# Altium project 4CH_PT100_INPUT_ISO.PrjPcb
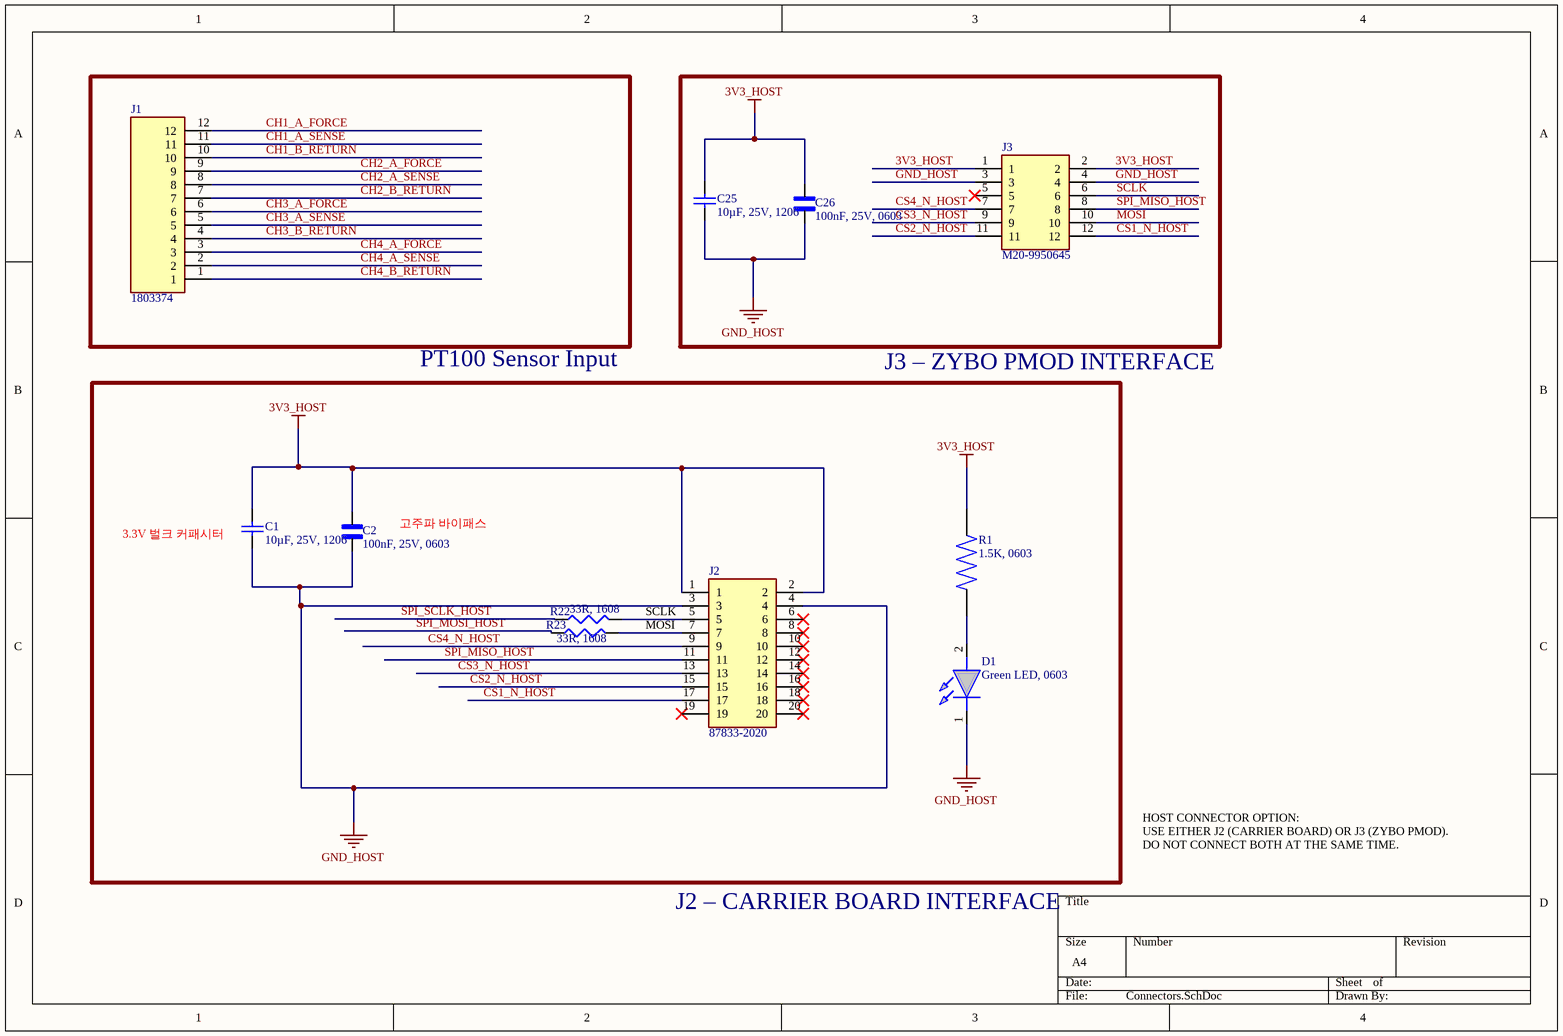
[diagram p0: Connectors.SchDoc]
5 sheets, 83 parts. Net scope: global (net labels, ports and power ports of the same name join across sheets).
Board file: 4CH_PT100_INPUT_ISO.PcbDoc
Sheets:
  Connectors.SchDoc
  CH1_CH2.SchDoc
  CH3_CH4.SchDoc
  ISOLATION.SchDoc
  TestPoint.SchDoc

## Sheet Connectors.SchDoc
size A4; SheetNumber: 1; SheetTotal: 5

### Parts
C1  10µF, 25V, 1206  [C1206]
C2  100nF, 25V, 0603  [CAPC1608X90N]
C25  10µF, 25V, 1206  [C1206]
C26  100nF, 25V, 0603  [CAPC1608X90N]
D1  Green LED, 0603  [LEDC1608X75N]
J1  1803374  [1803374]
J2  87833-2020  [SHDRRA20W55P200_2X10_2265X640X630P]
J3  M20-9950645  [HDRRA12W66P254_2X6_1524X254X508P]
R1  1.5K, 0603  [RESC1607X60N]
R22  33R, 1608  [J1-0603]
R23  33R, 1608  [J1-0603]

### Nets
3V3_HOST: C1.2 C2.2 C25.2 C26.2 J2.1 J2.2 J3.1 J3.2 R1.1
GND_HOST: C1.1 C2.1 C25.1 C26.1 D1.1(K) J2.3 J2.4 J3.3 J3.4
CH1_A_FORCE: J1.12
CH1_A_SENSE: J1.11
CH1_B_RETURN: J1.10
CH2_A_FORCE: J1.9
CH2_A_SENSE: J1.8
CH2_B_RETURN: J1.7
CH3_A_FORCE: J1.6
CH3_A_SENSE: J1.5
CH3_B_RETURN: J1.4
CH4_A_FORCE: J1.3
CH4_A_SENSE: J1.2
CH4_B_RETURN: J1.1
CS1_N_HOST: J2.17 J3.12
CS2_N_HOST: J2.15 J3.11
CS3_N_HOST: J2.13 J3.9
CS4_N_HOST: J2.9 J3.7
MOSI: J2.7 J3.10 R23.2
SCLK: J2.5 J3.6 R22.2
SPI_MISO_HOST: J2.11 J3.8
SPI_MOSI_HOST: R23.1
SPI_SCLK_HOST: R22.1
NetD1_2: D1.2(A) R1.2

Not connected (* = marked no-connect by the designer): J2 6* 8* 10* 12* 14* 16* 18* 19* 20*; J3 5*

### Notes on the sheet
- PT100 Sensor Input
- J3 – ZYBO PMOD INTERFACE
- (near C1) 3.3V 벌크 커패시터
- (near C2) 고주파 바이패스
- HOST CONNECTOR OPTION:
  USE EITHER J2 (CARRIER BOARD) OR J3 (ZYBO PMOD).
  DO NOT CONNECT BOTH AT THE SAME TIME.
- J2 – CARRIER BOARD INTERFACE

### Library data of the parts
C1 C25 = Cap Semi: 10µF, 25V, X7R, ±5%, 1206 / C1206C106J3RACTU; Value: 10uF; Published: 8-Jun-2000; LatestRevisionDate: 29-May-2009; LatestRevisionNote: IPC-7351 Footprint Added.; PackageReference: C1206; Publisher: Altium Limited; PackageDescription: Chip Capacitor
C2 C26 = CL10B104KA8VPJC: Multilayer Ceramic Capacitors MLCC - SMD/SMT; MF: Samsung Electro-Mechanics; SnapEDA_Link: https://www.snapeda.com/parts/CL10B104KA8VPJC/Samsung/view-part/?ref=snap; Package: SMD-2 Samsung; Value: *; MP: CL10B104KA8VPJC; Check_prices: https://www.snapeda.com/parts/CL10B104KA8VPJC/Samsung/view-part/?ref=eda
D1 = KPH-1608SGC: Green Chip LED 1.6x0.8mm Kingbright KPH-1608SGC, 603 Series Green LED, 568 nm 1608 (0603), Rectangle Lens SMD package; Geometry.Height: 0.75mm; element14 Part Number: *; element14 Price/Stock: *; Manufacturer_Name: Kingbright; Manufacturer_Part_Number: KPH-1608SGC; Datasheet Link: https://kingbright-europe.de/_daten/2013-2015KBE-P005-023-SMD-LED.pdf
J1 = 1803374: MC 1,5/12-G-3,81 - PCB headers, nominal cross section: 1.5 mm<sup>2</sup>, color: green, nominal current: 8 A, rated voltage (III/2): 160 V, contact surface: Sn, contact connection type: Pin, number of potentials: 12, number of rows: 1, number of positions: 12, number of connections: 12, product range: MC 1,5/..-G, pitch: 3.81 mm, screw head form: L Slotted, mounting: Wave soldering, pin layout: Linear pinning, solder pin [P]: 3.4 mm, number of solder pins per potential: 1, plug-in system: COMBICON MC 1,5,; Manufacturer_Name: Phoenix Contact; Geometry.Height: 8.25mm; Manufacturer_Part_Number: 1803374; Mouser Part Number: 651-1803374; Mouser Price/Stock: https://www.mouser.co.uk/ProductDetail/Phoenix-Contact/1803374?qs=%2FbRkJSLTVS9mX%2FTOf8pTQA%3D%3D; Arrow Part Number: 1803374; Arrow Price/Stock: https://www.arrow.com/en/products/1803374/phoenix-contact?utm_currency=USD&region=nac; Datasheet Link: https://www.phoenixcontact.com/en-us/products/pcb-header-mc-1512-g-381-1803374?type=pdf
J2 = 87833-2020: Milli-Grid 2.0mm Header rightangle 20way Molex 87833 Series, 2mm Pitch 20 Way 2 Row Right Angle PCB Header, Solder Termination, 2A; Geometry.Height: 6.3mm; Mouser Part Number: 538-87833-2020; Mouser Price/Stock: https://www.mouser.co.uk/ProductDetail/Molex/87833-2020?qs=9Wl4wMk6NjqIn8s9c3rdaw%3D%3D; Manufacturer_Name: Molex; Manufacturer_Part_Number: 87833-2020; Datasheet Link: https://www.molex.com/pdm_docs/sd/878332020_sd.pdf
J3 = M20-9950645: M20: 6+6 Pos Plug DIL Right-Angle 3mm THT Connector 6.1mm pin Gold; Manufacturer_Name: Harwin; Geometry.Height: 5.08mm; Mouser Part Number: 855-M20-9950645; Mouser Price/Stock: https://www.mouser.co.uk/ProductDetail/Harwin/M20-9950645?qs=WS5Jv%252B%252Bx1qVrnrdlGO%252BcnA%3D%3D; Manufacturer_Part_Number: M20-9950645; Datasheet Link: https://content.harwin.com/m/2bbbbcb217f49919/original/DRG-00474-Technical-Drawing-Datasheet-M20-995-pdf.pdf
R1 = RC0603FR-071K5L: 1.5 kOhms Â±1% 0.1W, 1/10W Chip Resistor 0603 (1608 Metric) Moisture Resistant Thick Film; MF: Yageo; SnapEDA_Link: https://www.snapeda.com/parts/RC0603FR-071K5L/Yageo/view-part/?ref=snap; Package: 0603 Yageo; Value: *; MP: RC0603FR-071K5L; Check_prices: https://www.snapeda.com/parts/RC0603FR-071K5L/Yageo/view-part/?ref=eda
R22 R23 = Res3: Resistor; Published: 8-Jun-2000; LatestRevisionDate: 29-May-2009; LatestRevisionNote: IPC-7351 Footprint Added.; PackageReference: J1-0603; Publisher: Altium Limited; PackageDescription: Chip Resistor; Value: 33R

## Sheet CH1_CH2.SchDoc
size A4; SheetNumber: 2; SheetTotal: 5
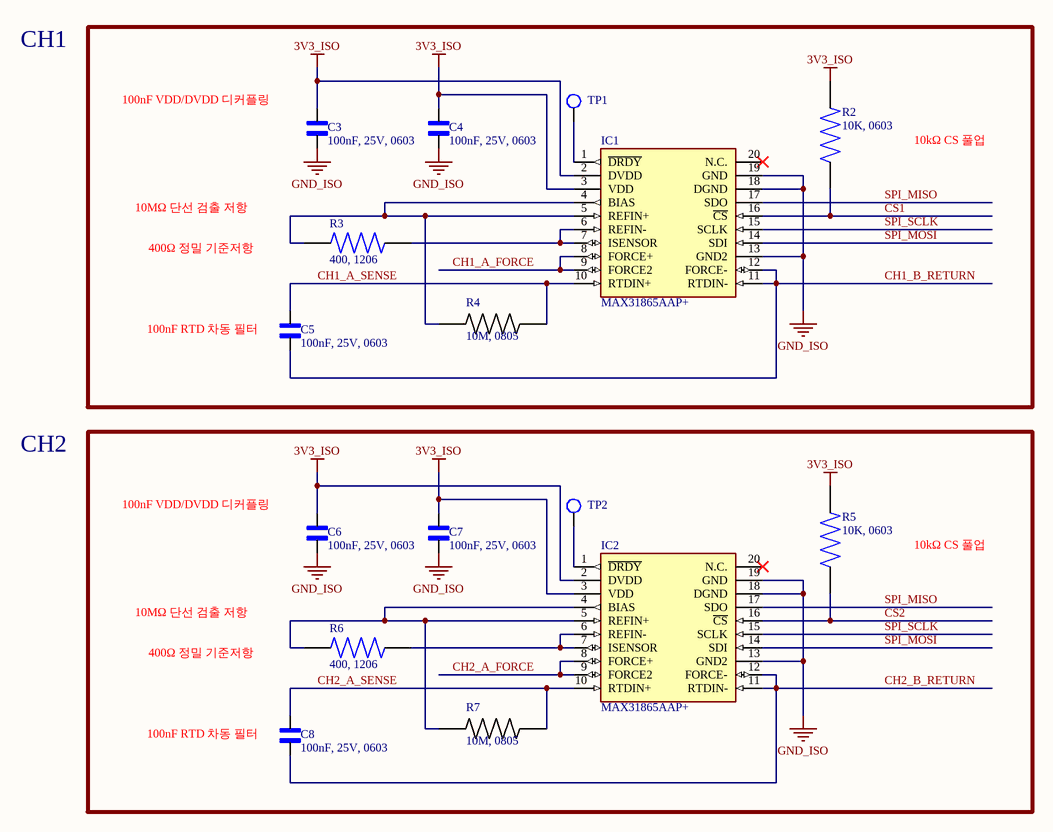
[diagram p1: CH1_CH2.SchDoc]

### Parts
C3  100nF, 25V, 0603  [CAPC1608X90N]
C4  100nF, 25V, 0603  [CAPC1608X90N]
C5  100nF, 25V, 0603  [CAPC1608X90N]
C6  100nF, 25V, 0603  [CAPC1608X90N]
C7  100nF, 25V, 0603  [CAPC1608X90N]
C8  100nF, 25V, 0603  [CAPC1608X90N]
IC1  MAX31865AAP+  [SOP65P778X199-20N]
IC2  MAX31865AAP+  [SOP65P778X199-20N]
R2  10K, 0603  [RESC1607X60N]
R3  400, 1206  [RESC3116X65N]
R4  10M, 0805  [*RESC2012X60N]
R5  10K, 0603  [RESC1607X60N]
R6  400, 1206  [RESC3116X65N]
R7  10M, 0805  [*RESC2012X60N]
TP1  TEST POINT  [TESTPOINT]  (value not drawn)
TP2  TEST POINT  [TESTPOINT]  (value not drawn)

### Nets
3V3_ISO: C3.2 C4.2 C6.2 C7.2 IC1.2(DVDD) IC1.3(VDD) IC2.2(DVDD) IC2.3(VDD) R2.2 R5.2
GND_ISO: C3.1 C4.1 C6.1 C7.1 IC1.13(GND2) IC1.18(DGND) IC1.19(GND) IC2.13(GND2) IC2.18(DGND) IC2.19(GND)
CH1_A_FORCE: IC1.8(FORCE+) IC1.9(FORCE2)
CH1_A_SENSE: C5.2 IC1.10(RTDIN+) R4.2
CH1_B_RETURN: C5.1 IC1.11(RTDIN-) IC1.12(FORCE-)
CH2_A_FORCE: IC2.8(FORCE+) IC2.9(FORCE2)
CH2_A_SENSE: C8.2 IC2.10(RTDIN+) R7.2
CH2_B_RETURN: C8.1 IC2.11(RTDIN-) IC2.12(FORCE-)
CS1: IC1.16(~{CS}) R2.1
CS2: IC2.16(~{CS}) R5.1
SPI_MISO: IC1.17(SDO) IC2.17(SDO)
SPI_MOSI: IC1.14(SDI) IC2.14(SDI)
SPI_SCLK: IC1.15(SCLK) IC2.15(SCLK)
NetIC1_1: IC1.1(~{DRDY}) TP1.1
NetIC1_4: IC1.4(BIAS) IC1.5(REFIN+) R3.1 R4.1
NetIC1_6: IC1.6(REFIN-) IC1.7(ISENSOR) R3.2
NetIC2_1: IC2.1(~{DRDY}) TP2.1
NetIC2_4: IC2.4(BIAS) IC2.5(REFIN+) R6.1 R7.1
NetIC2_6: IC2.6(REFIN-) IC2.7(ISENSOR) R6.2

Not connected (* = marked no-connect by the designer): IC1 20(N.C.)*; IC2 20(N.C.)*

### Notes on the sheet
- CH1
- (near C3) 100nF VDD/DVDD 디커플링
- 10kΩ CS 풀업
- 10MΩ 단선 검출 저항
- 400Ω 정밀 기준저항
- (near C5) 100nF RTD 차동 필터
- CH2
- (near C6) 100nF VDD/DVDD 디커플링
- (near C8) 100nF RTD 차동 필터

### Library data of the parts
C3-C8 = CL10B104KA8VPJC: as C2 on sheet Connectors; SnapEDA_Link: https://www.snapeda.com/parts/CL10B104KA8VPJC/Samsung/view-part/?ref=snap; Package: SMD-2 Samsung; Value: *; MP: CL10B104KA8VPJC; Check_prices: https://www.snapeda.com/parts/CL10B104KA8VPJC/Samsung/view-part/?ref=eda
IC1 IC2 = MAX31865AAP+: Integrated Circuit; Manufacturer_Name: Analog Devices; Datasheet Link: https://www.analog.com/MAX31865/datasheet; Height: 1.99mm; Manufacturer_Part_Number: MAX31865AAP+; Mouser Part Number: 700-MAX31865AAP+; Mouser Price/Stock: https://www.mouser.co.uk/ProductDetail/Analog-Devices-Maxim-Integrated/MAX31865AAP%2b?qs=PVVDbbWpW3IB0xqHe0DjLw%3D%3D; Arrow Part Number: MAX31865AAP+; Arrow Price/Stock: https://www.arrow.com/en/products/max31865aap/analog-devices.html?utm_currency=USD&region=europe
R2 R5 = RC0603FR-0710KL: 10 kOhms ±1% 0.1W, 1/10W Chip Resistor 0603 (1608 Metric) Moisture Resistant Thick Film; MF: Yageo Corporation; MP: RC0603FR0710KL; SnapEDA_Link: https://www.snapeda.com/parts/RC0603FR0710KL/Yageo/view-part/?ref=snap; Package: 0603-2 YAGEO; Value: *; Check_prices: https://www.snapeda.com/parts/RC0603FR0710KL/Yageo/view-part/?ref=eda
R3 R6 = RT1206BRD07400RL: 400 Ohms Â±0.1% 0.25W, 1/4W Chip Resistor 1206 (3216 Metric) - Thin Film; MF: Yageo; SnapEDA_Link: https://www.snapeda.com/parts/RT1206BRD07400RL/Yageo/view-part/?ref=snap; Package: 3116 Yageo; Value: *; MP: RT1206BRD07400RL; Check_prices: https://www.snapeda.com/parts/RT1206BRD07400RL/Yageo/view-part/?ref=eda
R4 R7 = AC0805FR-1010ML: 10MΩ, ±1%, 125mW, 0805, AEC-Q200; SnapEDA_Link: https://www.snapeda.com/parts/AC0805FR-1010ML/Yageo/view-part/?ref=snap; Check_prices: https://www.snapeda.com/parts/AC0805FR-1010ML/Yageo/view-part/?ref=eda; Value: *

## Sheet CH3_CH4.SchDoc
size A4; SheetNumber: 3; SheetTotal: 5
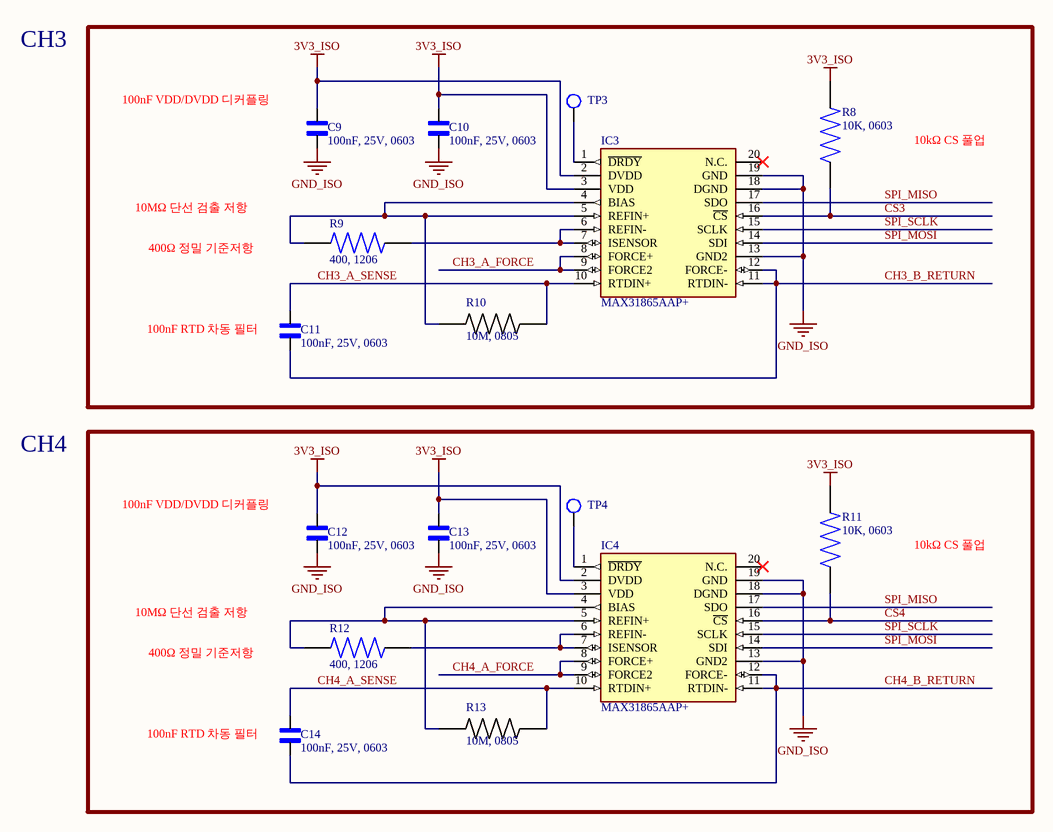
[diagram p2: CH3_CH4.SchDoc]

### Parts
C9  100nF, 25V, 0603  [CAPC1608X90N]
C10  100nF, 25V, 0603  [CAPC1608X90N]
C11  100nF, 25V, 0603  [CAPC1608X90N]
C12  100nF, 25V, 0603  [CAPC1608X90N]
C13  100nF, 25V, 0603  [CAPC1608X90N]
C14  100nF, 25V, 0603  [CAPC1608X90N]
IC3  MAX31865AAP+  [SOP65P778X199-20N]
IC4  MAX31865AAP+  [SOP65P778X199-20N]
R8  10K, 0603  [RESC1607X60N]
R9  400, 1206  [RESC3116X65N]
R10  10M, 0805  [*RESC2012X60N]
R11  10K, 0603  [RESC1607X60N]
R12  400, 1206  [RESC3116X65N]
R13  10M, 0805  [*RESC2012X60N]
TP3  TEST POINT  [TESTPOINT]  (value not drawn)
TP4  TEST POINT  [TESTPOINT]  (value not drawn)

### Nets
3V3_ISO: C9.2 C10.2 C12.2 C13.2 IC3.2(DVDD) IC3.3(VDD) IC4.2(DVDD) IC4.3(VDD) R8.2 R11.2
GND_ISO: C9.1 C10.1 C12.1 C13.1 IC3.13(GND2) IC3.18(DGND) IC3.19(GND) IC4.13(GND2) IC4.18(DGND) IC4.19(GND)
CH3_A_FORCE: IC3.8(FORCE+) IC3.9(FORCE2)
CH3_A_SENSE: C11.2 IC3.10(RTDIN+) R10.2
CH3_B_RETURN: C11.1 IC3.11(RTDIN-) IC3.12(FORCE-)
CH4_A_FORCE: IC4.8(FORCE+) IC4.9(FORCE2)
CH4_A_SENSE: C14.2 IC4.10(RTDIN+) R13.2
CH4_B_RETURN: C14.1 IC4.11(RTDIN-) IC4.12(FORCE-)
CS3: IC3.16(~{CS}) R8.1
CS4: IC4.16(~{CS}) R11.1
SPI_MISO: IC3.17(SDO) IC4.17(SDO)
SPI_MOSI: IC3.14(SDI) IC4.14(SDI)
SPI_SCLK: IC3.15(SCLK) IC4.15(SCLK)
NetIC3_1: IC3.1(~{DRDY}) TP3.1
NetIC3_4: IC3.4(BIAS) IC3.5(REFIN+) R9.1 R10.1
NetIC3_6: IC3.6(REFIN-) IC3.7(ISENSOR) R9.2
NetIC4_1: IC4.1(~{DRDY}) TP4.1
NetIC4_4: IC4.4(BIAS) IC4.5(REFIN+) R12.1 R13.1
NetIC4_6: IC4.6(REFIN-) IC4.7(ISENSOR) R12.2

Not connected (* = marked no-connect by the designer): IC3 20(N.C.)*; IC4 20(N.C.)*

### Notes on the sheet
- CH3
- (near C9) 100nF VDD/DVDD 디커플링
- 10kΩ CS 풀업
- 10MΩ 단선 검출 저항
- 400Ω 정밀 기준저항
- (near C11) 100nF RTD 차동 필터
- CH4
- (near C12) 100nF VDD/DVDD 디커플링
- (near C14) 100nF RTD 차동 필터

### Library data of the parts
C9-C14 = CL10B104KA8VPJC: as C2 on sheet Connectors; SnapEDA_Link: https://www.snapeda.com/parts/CL10B104KA8VPJC/Samsung/view-part/?ref=snap; Package: SMD-2 Samsung; Value: *; MP: CL10B104KA8VPJC; Check_prices: https://www.snapeda.com/parts/CL10B104KA8VPJC/Samsung/view-part/?ref=eda
IC3 IC4 = MAX31865AAP+: as IC1 on sheet CH1_CH2; Datasheet Link: https://www.analog.com/MAX31865/datasheet; Height: 1.99mm; Manufacturer_Part_Number: MAX31865AAP+; Mouser Part Number: 700-MAX31865AAP+; Mouser Price/Stock: https://www.mouser.co.uk/ProductDetail/Analog-Devices-Maxim-Integrated/MAX31865AAP%2b?qs=PVVDbbWpW3IB0xqHe0DjLw%3D%3D; Arrow Part Number: MAX31865AAP+; Arrow Price/Stock: https://www.arrow.com/en/products/max31865aap/analog-devices.html?utm_currency=USD&region=europe
R8 R11 = RC0603FR-0710KL: as R2 on sheet CH1_CH2; SnapEDA_Link: https://www.snapeda.com/parts/RC0603FR0710KL/Yageo/view-part/?ref=snap; Package: 0603-2 YAGEO; Value: *; Check_prices: https://www.snapeda.com/parts/RC0603FR0710KL/Yageo/view-part/?ref=eda
R9 R12 = RT1206BRD07400RL: as R3 on sheet CH1_CH2; SnapEDA_Link: https://www.snapeda.com/parts/RT1206BRD07400RL/Yageo/view-part/?ref=snap; Package: 3116 Yageo; Value: *; MP: RT1206BRD07400RL; Check_prices: https://www.snapeda.com/parts/RT1206BRD07400RL/Yageo/view-part/?ref=eda
R10 R13 = AC0805FR-1010ML: 10MΩ, ±1%, 125mW, 0805, AEC-Q200; SnapEDA_Link: https://www.snapeda.com/parts/AC0805FR-1010ML/Yageo/view-part/?ref=snap; Check_prices: https://www.snapeda.com/parts/AC0805FR-1010ML/Yageo/view-part/?ref=eda; Value: *

## Sheet ISOLATION.SchDoc
size A4; SheetNumber: 4; SheetTotal: 5
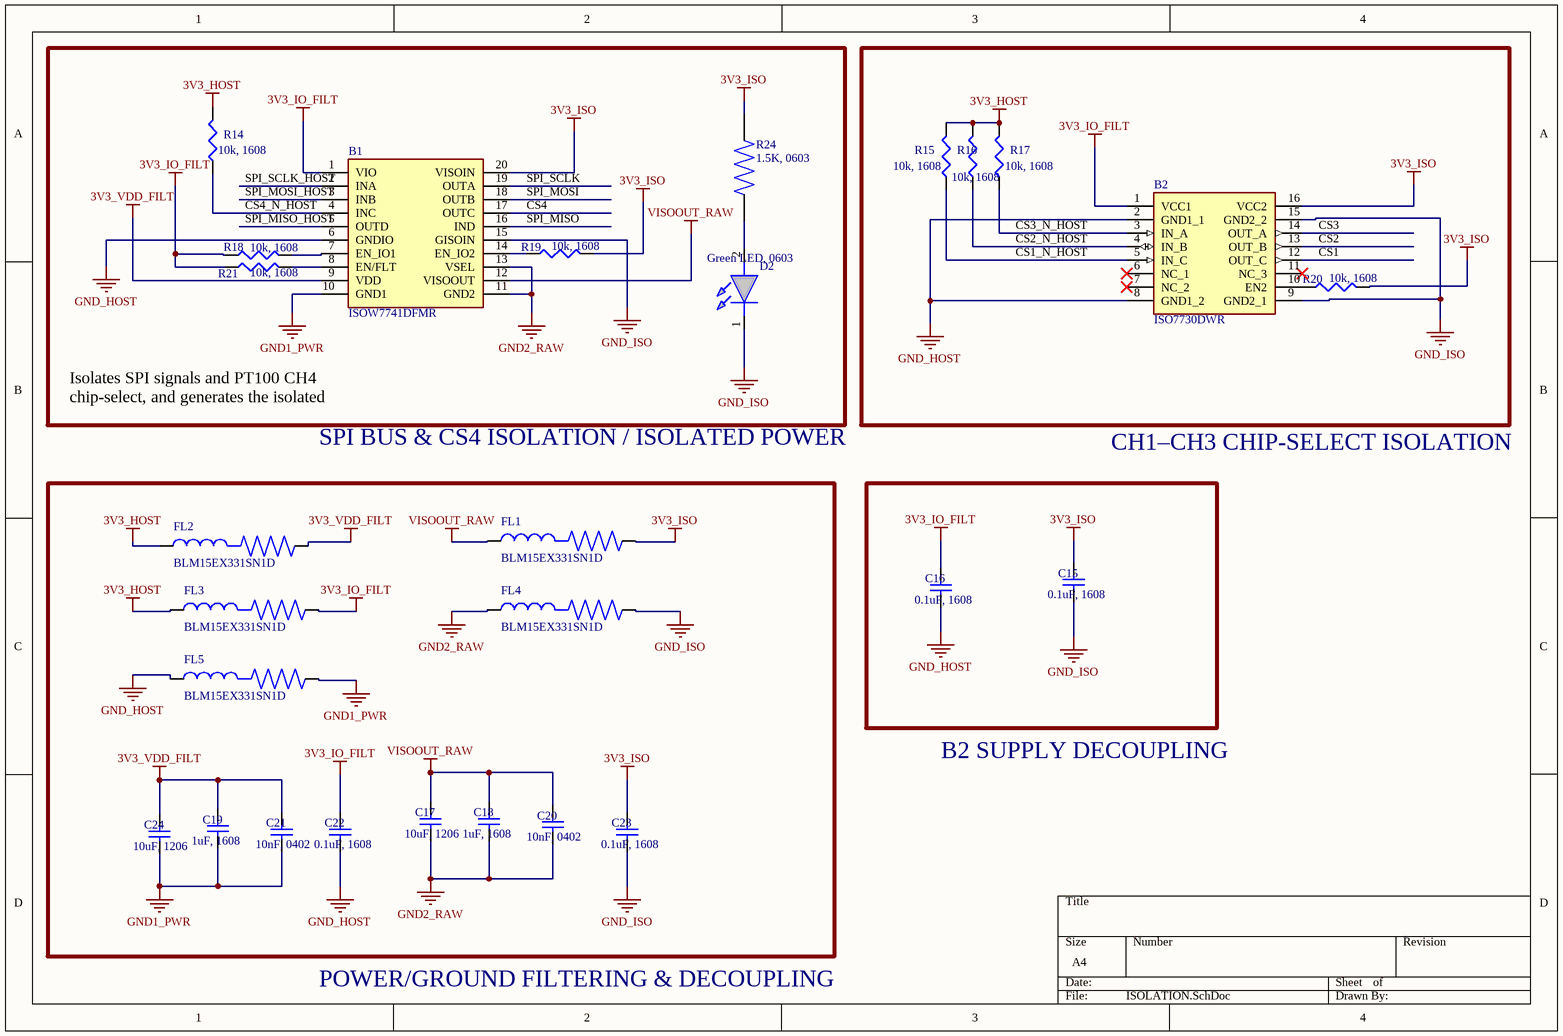
[diagram p3: ISOLATION.SchDoc]

### Parts
B1  ISOW7741DFMR  [SOIC127P1030X355-20N]
B2  ISO7730DWR  [SOIC127P1030X265-16N]
C15  0.1uF, 1608  [1608[0603]]
C16  0.1uF, 1608  [1608[0603]]
C17  10uF, 1206  [C1206]
C18  1uF, 1608  [1608[0603]]
C19  1uF, 1608  [1608[0603]]
C20  10nF, 0402  [0402]
C21  10nF, 0402  [0402]
C22  0.1uF, 1608  [1608[0603]]
C23  0.1uF, 1608  [1608[0603]]
C24  10uF, 1206  [C1206]
D2  Green LED, 0603  [LEDC1608X75N]
FL1  BLM15EX331SN1D  [BEADC1005X55N]
FL2  BLM15EX331SN1D  [BEADC1005X55N]
FL3  BLM15EX331SN1D  [BEADC1005X55N]
FL4  BLM15EX331SN1D  [BEADC1005X55N]
FL5  BLM15EX331SN1D  [BEADC1005X55N]
R14  10k, 1608  [J1-0603]
R15  10k, 1608  [J1-0603]
R16  10k, 1608  [J1-0603]
R17  10k, 1608  [J1-0603]
R18  10k, 1608  [J1-0603]
R19  10k, 1608  [J1-0603]
R20  10k, 1608  [J1-0603]
R21  10k, 1608  [J1-0603]
R24  1.5K, 0603  [RESC1607X60N]

### Nets
3V3_HOST: FL2.1 FL3.1 R14.2 R15.2 R16.2 R17.2
3V3_IO_FILT: B1.1(VIO) B2.1(VCC1) C16.2 C22.2 FL3.2 R18.1 R21.1
3V3_ISO: B1.20(VISOIN) B2.16(VCC2) C15.2 C23.2 FL1.2 R19.2 R20.2 R24.1
3V3_VDD_FILT: B1.9(VDD) C19.2 C21.2 C24.2 FL2.2
GND1_PWR: B1.10(GND1) C19.1 C21.1 C24.1 FL5.2
GND2_RAW: B1.11(GND2) B1.13(VSEL) C17.1 C18.1 C20.1 FL4.1
GND_HOST: B1.6(GNDIO) B2.2(GND1_1) B2.8(GND1_2) C16.1 C22.1 FL5.1
GND_ISO: B1.15(GISOIN) B2.9(GND2_1) B2.15(GND2_2) C15.1 C23.1 D2.1(K) FL4.2
VISOOUT_RAW: B1.12(VISOOUT) C17.2 C18.2 C20.2 FL1.1
CS1: B2.12(OUT_C)
CS1_N_HOST: B2.5(IN_C) R15.1
CS2: B2.13(OUT_B)
CS2_N_HOST: B2.4(IN_B) R16.1
CS3: B2.14(OUT_A)
CS3_N_HOST: B2.3(IN_A) R17.1
CS4: B1.17(OUTC)
CS4_N_HOST: B1.4(INC) R14.1
SPI_MISO: B1.16(IND)
SPI_MISO_HOST: B1.5(OUTD)
SPI_MOSI: B1.18(OUTB)
SPI_MOSI_HOST: B1.3(INB)
SPI_SCLK: B1.19(OUTA)
SPI_SCLK_HOST: B1.2(INA)
NetB1_7: B1.7(EN_IO1) R18.2
NetB1_8: B1.8(EN/FLT) R21.2
NetB1_14: B1.14(EN_IO2) R19.1
NetB2_10: B2.10(EN2) R20.1
NetD2_2: D2.2(A) R24.2

Not connected (* = marked no-connect by the designer): B2 6(NC_1)* 7(NC_2)* 11(NC_3)*

### Notes on the sheet
- Isolates SPI signals and PT100 CH4 chip-select, and generates the isolated supply.
- SPI BUS & CS4 ISOLATION / ISOLATED POWER
- CH1–CH3 CHIP-SELECT ISOLATION
- B2 SUPPLY DECOUPLING
- POWER/GROUND FILTERING & DECOUPLING

### Library data of the parts
B1 = ISOW7741DFMR: ISOW7741 Quad-Channel Digital Isolator with Integrated Low-Emissions, Low-Noise DC-DC Converter; Manufacturer_Name: Texas Instruments; Geometry.Height: 3.55mm; Mouser Part Number: 595-ISOW7741DFMR; Mouser Price/Stock: https://www.mouser.co.uk/ProductDetail/Texas-Instruments/ISOW7741DFMR?qs=TCDPyi3sCW2lvMJ%252B%2FuKOng%3D%3D; Manufacturer_Part_Number: ISOW7741DFMR; Datasheet Link: https://www.ti.com/lit/ds/symlink/isow7741.pdf?ts=1638340822813&ref_url=https%253A%252F%252Fwww.ti.com%252Fproduct%252FISOW7741
B2 = ISO7730DWR: Integrated Circuit; Manufacturer_Name: Texas Instruments; Datasheet Link: http://www.ti.com/lit/gpn/iso7730; Height: 2.65mm; Manufacturer_Part_Number: ISO7730DWR; Mouser Part Number: 595-ISO7730DWR; Mouser Price/Stock: https://www.mouser.co.uk/ProductDetail/Texas-Instruments/ISO7730DWR?qs=d557%2FRYZ0%2FpU9%252BX01Fh6Sw%3D%3D; Arrow Part Number: ISO7730DWR; Arrow Price/Stock: https://www.arrow.com/en/products/iso7730dwr/texas-instruments?region=nac
C15 C16 C18-C23 = Cap Semi: Capacitor (Semiconductor SIM Model); Published: 8-Jun-2000; LatestRevisionDate: 29-May-2009; LatestRevisionNote: IPC-7351 Footprint Added.; PackageReference: C1206; Publisher: Altium Limited; PackageDescription: Chip Capacitor
  C15 C16 C22 C23: Value: 0.1uF
  C18 C19: Value: 1uF
  C20 C21: Value: 10nF
C17 C24 = Cap Semi: C1206C106J3RACTU; Published: 8-Jun-2000; LatestRevisionDate: 29-May-2009; LatestRevisionNote: IPC-7351 Footprint Added.; PackageReference: C1206; Publisher: Altium Limited; PackageDescription: Chip Capacitor; Value: 10uF
D2 = KPH-1608SGC: as D1 on sheet Connectors; element14 Part Number: *; element14 Price/Stock: *; Manufacturer_Name: Kingbright; Manufacturer_Part_Number: KPH-1608SGC; Datasheet Link: https://kingbright-europe.de/_daten/2013-2015KBE-P005-023-SMD-LED.pdf
FL1-FL5 = BLM15EX331SN1D: 330 Ohms @ 100 MHz 1 Power, Signal Line Ferrite Bead 0402 (1005 Metric) 1.1A 205mOhm; MF: Murata; SnapEDA_Link: https://www.snapeda.com/parts/BLM15EX331SN1D/Murata/view-part/?ref=snap; Package: 1005 Taiyo Yuden; Value: *; MP: BLM15EX331SN1D; Check_prices: https://www.snapeda.com/parts/BLM15EX331SN1D/Murata/view-part/?ref=eda
R14-R21 = Res3: Resistor; Published: 8-Jun-2000; LatestRevisionDate: 29-May-2009; LatestRevisionNote: IPC-7351 Footprint Added.; PackageReference: J1-0603; Publisher: Altium Limited; PackageDescription: Chip Resistor; Value: 10k
R24 = RC0603FR-071K5L: as R1 on sheet Connectors; SnapEDA_Link: https://www.snapeda.com/parts/RC0603FR-071K5L/Yageo/view-part/?ref=snap; Package: 0603 Yageo; Value: *; MP: RC0603FR-071K5L; Check_prices: https://www.snapeda.com/parts/RC0603FR-071K5L/Yageo/view-part/?ref=eda

## Sheet TestPoint.SchDoc
size A4; SheetNumber: 5; SheetTotal: 5
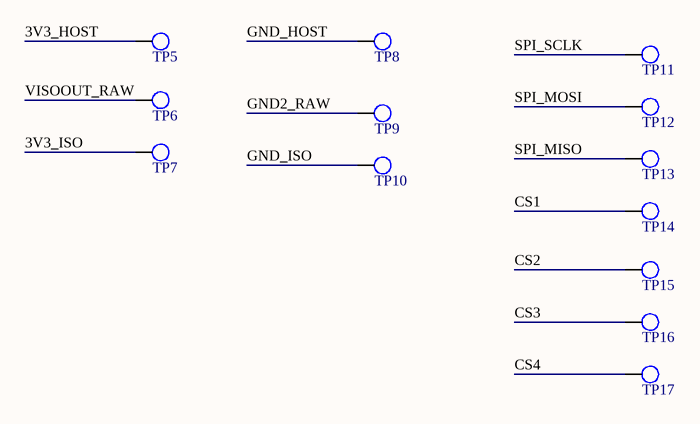
[diagram p4: TestPoint.SchDoc]

### Parts
TP5  TEST POINT  [TESTPOINT]  (value not drawn)
TP6  TEST POINT  [TESTPOINT]  (value not drawn)
TP7  TEST POINT  [TESTPOINT]  (value not drawn)
TP8  TEST POINT  [TESTPOINT]  (value not drawn)
TP9  TEST POINT  [TESTPOINT]  (value not drawn)
TP10  TEST POINT  [TESTPOINT]  (value not drawn)
TP11  TEST POINT  [TESTPOINT]  (value not drawn)
TP12  TEST POINT  [TESTPOINT]  (value not drawn)
TP13  TEST POINT  [TESTPOINT]  (value not drawn)
TP14  TEST POINT  [TESTPOINT]  (value not drawn)
TP15  TEST POINT  [TESTPOINT]  (value not drawn)
TP16  TEST POINT  [TESTPOINT]  (value not drawn)
TP17  TEST POINT  [TESTPOINT]  (value not drawn)

### Nets
3V3_HOST: TP5.1
3V3_ISO: TP7.1
GND2_RAW: TP9.1
GND_HOST: TP8.1
GND_ISO: TP10.1
VISOOUT_RAW: TP6.1
CS1: TP14.1
CS2: TP15.1
CS3: TP16.1
CS4: TP17.1
SPI_MISO: TP13.1
SPI_MOSI: TP12.1
SPI_SCLK: TP11.1

## Nets that join several sheets
3V3_HOST: Connectors (9 pins), ISOLATION (6 pins), TestPoint (TP5.1)
3V3_ISO: CH1_CH2 (10 pins), CH3_CH4 (10 pins), ISOLATION (8 pins), TestPoint (TP7.1)
GND2_RAW: ISOLATION (6 pins), TestPoint (TP9.1)
GND_HOST: Connectors (9 pins), ISOLATION (6 pins), TestPoint (TP8.1)
GND_ISO: CH1_CH2 (10 pins), CH3_CH4 (10 pins), ISOLATION (7 pins), TestPoint (TP10.1)
VISOOUT_RAW: ISOLATION (5 pins), TestPoint (TP6.1)
CH1_A_FORCE: Connectors (J1.12), CH1_CH2 (IC1.8 IC1.9)
CH1_A_SENSE: Connectors (J1.11), CH1_CH2 (C5.2 IC1.10 R4.2)
CH1_B_RETURN: Connectors (J1.10), CH1_CH2 (C5.1 IC1.11 IC1.12)
CH2_A_FORCE: Connectors (J1.9), CH1_CH2 (IC2.8 IC2.9)
CH2_A_SENSE: Connectors (J1.8), CH1_CH2 (C8.2 IC2.10 R7.2)
CH2_B_RETURN: Connectors (J1.7), CH1_CH2 (C8.1 IC2.11 IC2.12)
CH3_A_FORCE: Connectors (J1.6), CH3_CH4 (IC3.8 IC3.9)
CH3_A_SENSE: Connectors (J1.5), CH3_CH4 (C11.2 IC3.10 R10.2)
CH3_B_RETURN: Connectors (J1.4), CH3_CH4 (C11.1 IC3.11 IC3.12)
CH4_A_FORCE: Connectors (J1.3), CH3_CH4 (IC4.8 IC4.9)
CH4_A_SENSE: Connectors (J1.2), CH3_CH4 (C14.2 IC4.10 R13.2)
CH4_B_RETURN: Connectors (J1.1), CH3_CH4 (C14.1 IC4.11 IC4.12)
CS1: CH1_CH2 (IC1.16 R2.1), ISOLATION (B2.12), TestPoint (TP14.1)
CS1_N_HOST: Connectors (J2.17 J3.12), ISOLATION (B2.5 R15.1)
CS2: CH1_CH2 (IC2.16 R5.1), ISOLATION (B2.13), TestPoint (TP15.1)
CS2_N_HOST: Connectors (J2.15 J3.11), ISOLATION (B2.4 R16.1)
CS3: CH3_CH4 (IC3.16 R8.1), ISOLATION (B2.14), TestPoint (TP16.1)
CS3_N_HOST: Connectors (J2.13 J3.9), ISOLATION (B2.3 R17.1)
CS4: CH3_CH4 (IC4.16 R11.1), ISOLATION (B1.17), TestPoint (TP17.1)
CS4_N_HOST: Connectors (J2.9 J3.7), ISOLATION (B1.4 R14.1)
SPI_MISO: CH1_CH2 (IC1.17 IC2.17), CH3_CH4 (IC3.17 IC4.17), ISOLATION (B1.16), TestPoint (TP13.1)
SPI_MISO_HOST: Connectors (J2.11 J3.8), ISOLATION (B1.5)
SPI_MOSI: CH1_CH2 (IC1.14 IC2.14), CH3_CH4 (IC3.14 IC4.14), ISOLATION (B1.18), TestPoint (TP12.1)
SPI_MOSI_HOST: Connectors (R23.1), ISOLATION (B1.3)
SPI_SCLK: CH1_CH2 (IC1.15 IC2.15), CH3_CH4 (IC3.15 IC4.15), ISOLATION (B1.19), TestPoint (TP11.1)
SPI_SCLK_HOST: Connectors (R22.1), ISOLATION (B1.2)